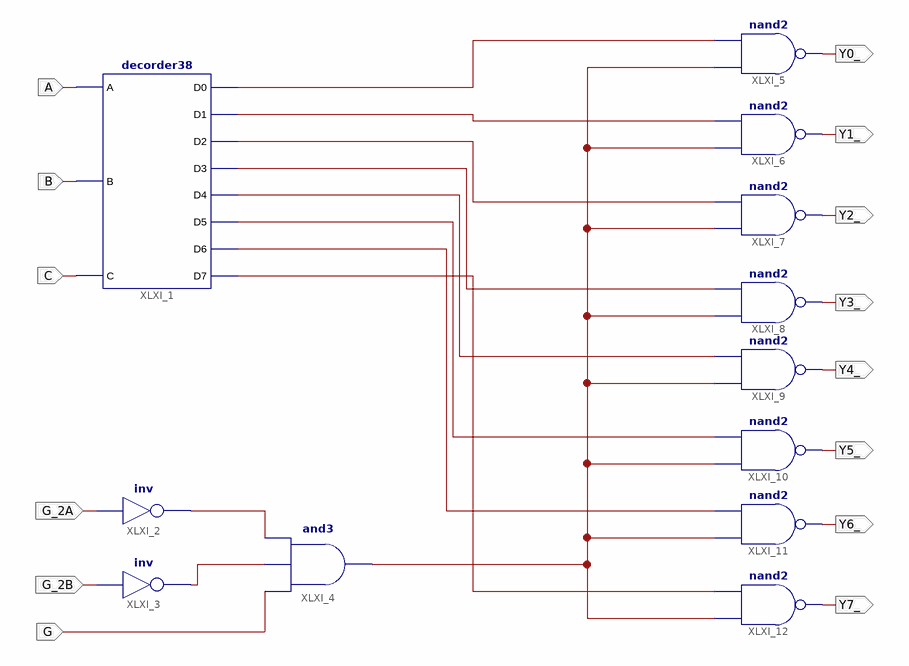
[diagram p0: schematic sheet 1]
// Xilinx ISE schematic HTC138.sch (spartan3) as structural Verilog: 12 symbols, 14 ports
module HTC138 (
  input  A,
  input  B,
  input  C,
  input  G_2A,
  input  G_2B,
  input  G,
  output Y0_,
  output Y1_,
  output Y2_,
  output Y3_,
  output Y4_,
  output Y5_,
  output Y6_,
  output Y7_
);

  wire XLXN_15, XLXN_16, XLXN_25, XLXN_26, XLXN_27, XLXN_28, XLXN_29, XLXN_30, XLXN_31, XLXN_32, XLXN_40;

  decorder38 XLXI_1 (
    .A(A), .B(B), .C(C), .D0(XLXN_26), .D1(XLXN_27), .D2(XLXN_28), .D3(XLXN_29), .D4(XLXN_30), .D5(XLXN_31),
    .D6(XLXN_32), .D7(XLXN_40));
  not XLXI_2 (XLXN_15, G_2A);
  not XLXI_3 (XLXN_16, G_2B);
  and XLXI_4 (XLXN_25, G, XLXN_16, XLXN_15);
  nand XLXI_5 (Y0_, XLXN_25, XLXN_26);
  nand XLXI_6 (Y1_, XLXN_25, XLXN_27);
  nand XLXI_7 (Y2_, XLXN_25, XLXN_28);
  nand XLXI_8 (Y3_, XLXN_25, XLXN_29);
  nand XLXI_9 (Y4_, XLXN_25, XLXN_30);
  nand XLXI_10 (Y5_, XLXN_25, XLXN_31);
  nand XLXI_11 (Y6_, XLXN_25, XLXN_32);
  nand XLXI_12 (Y7_, XLXN_25, XLXN_40);
endmodule
